# EAGLE schematic Hornet UFC 020a (EAGLE 9.2.2)
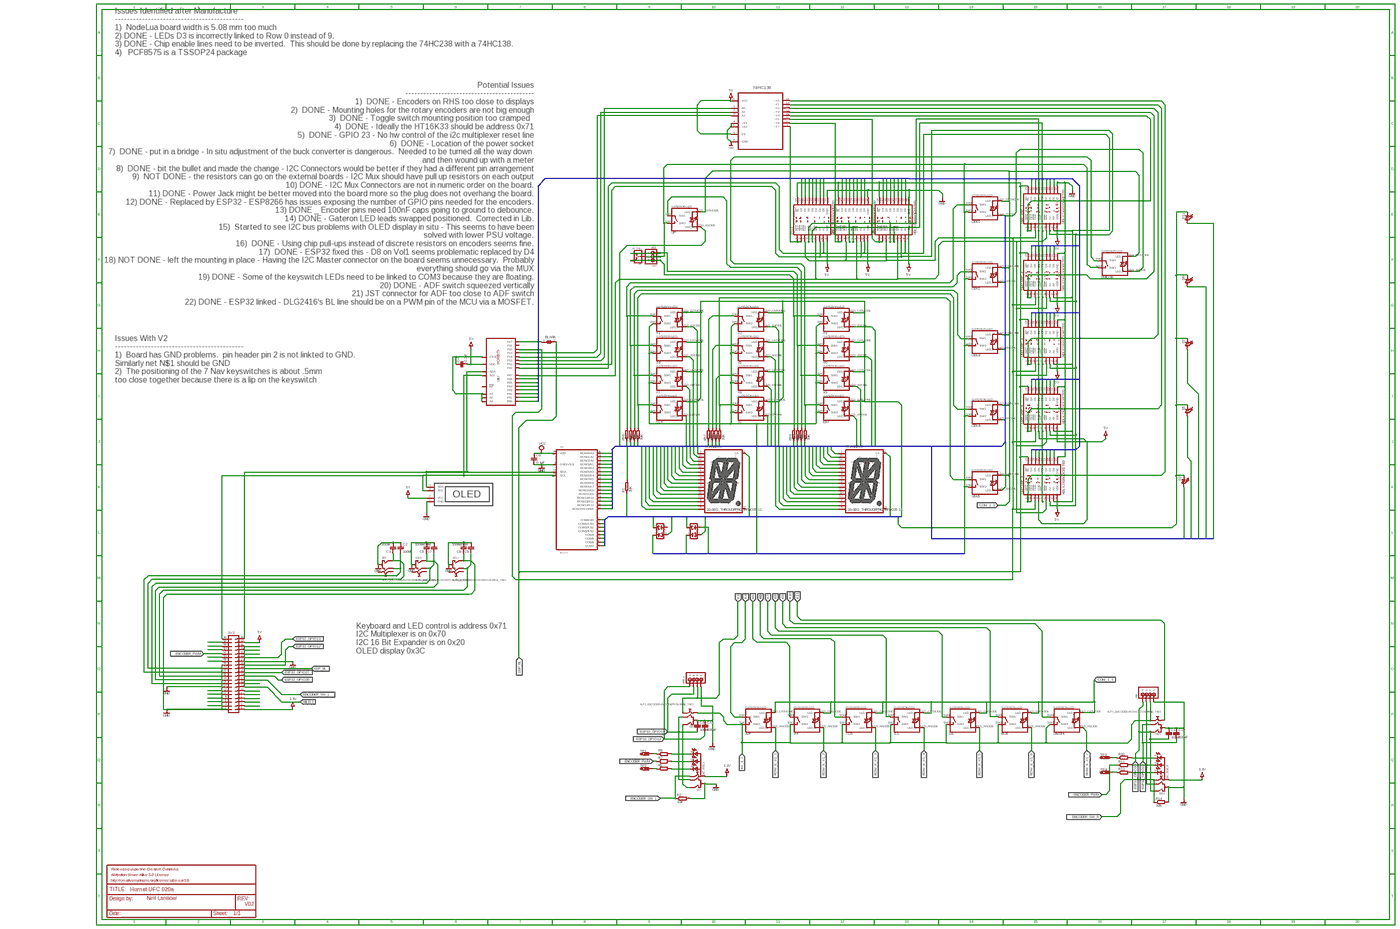
[diagram p0: schematic, sheet 1, overview]
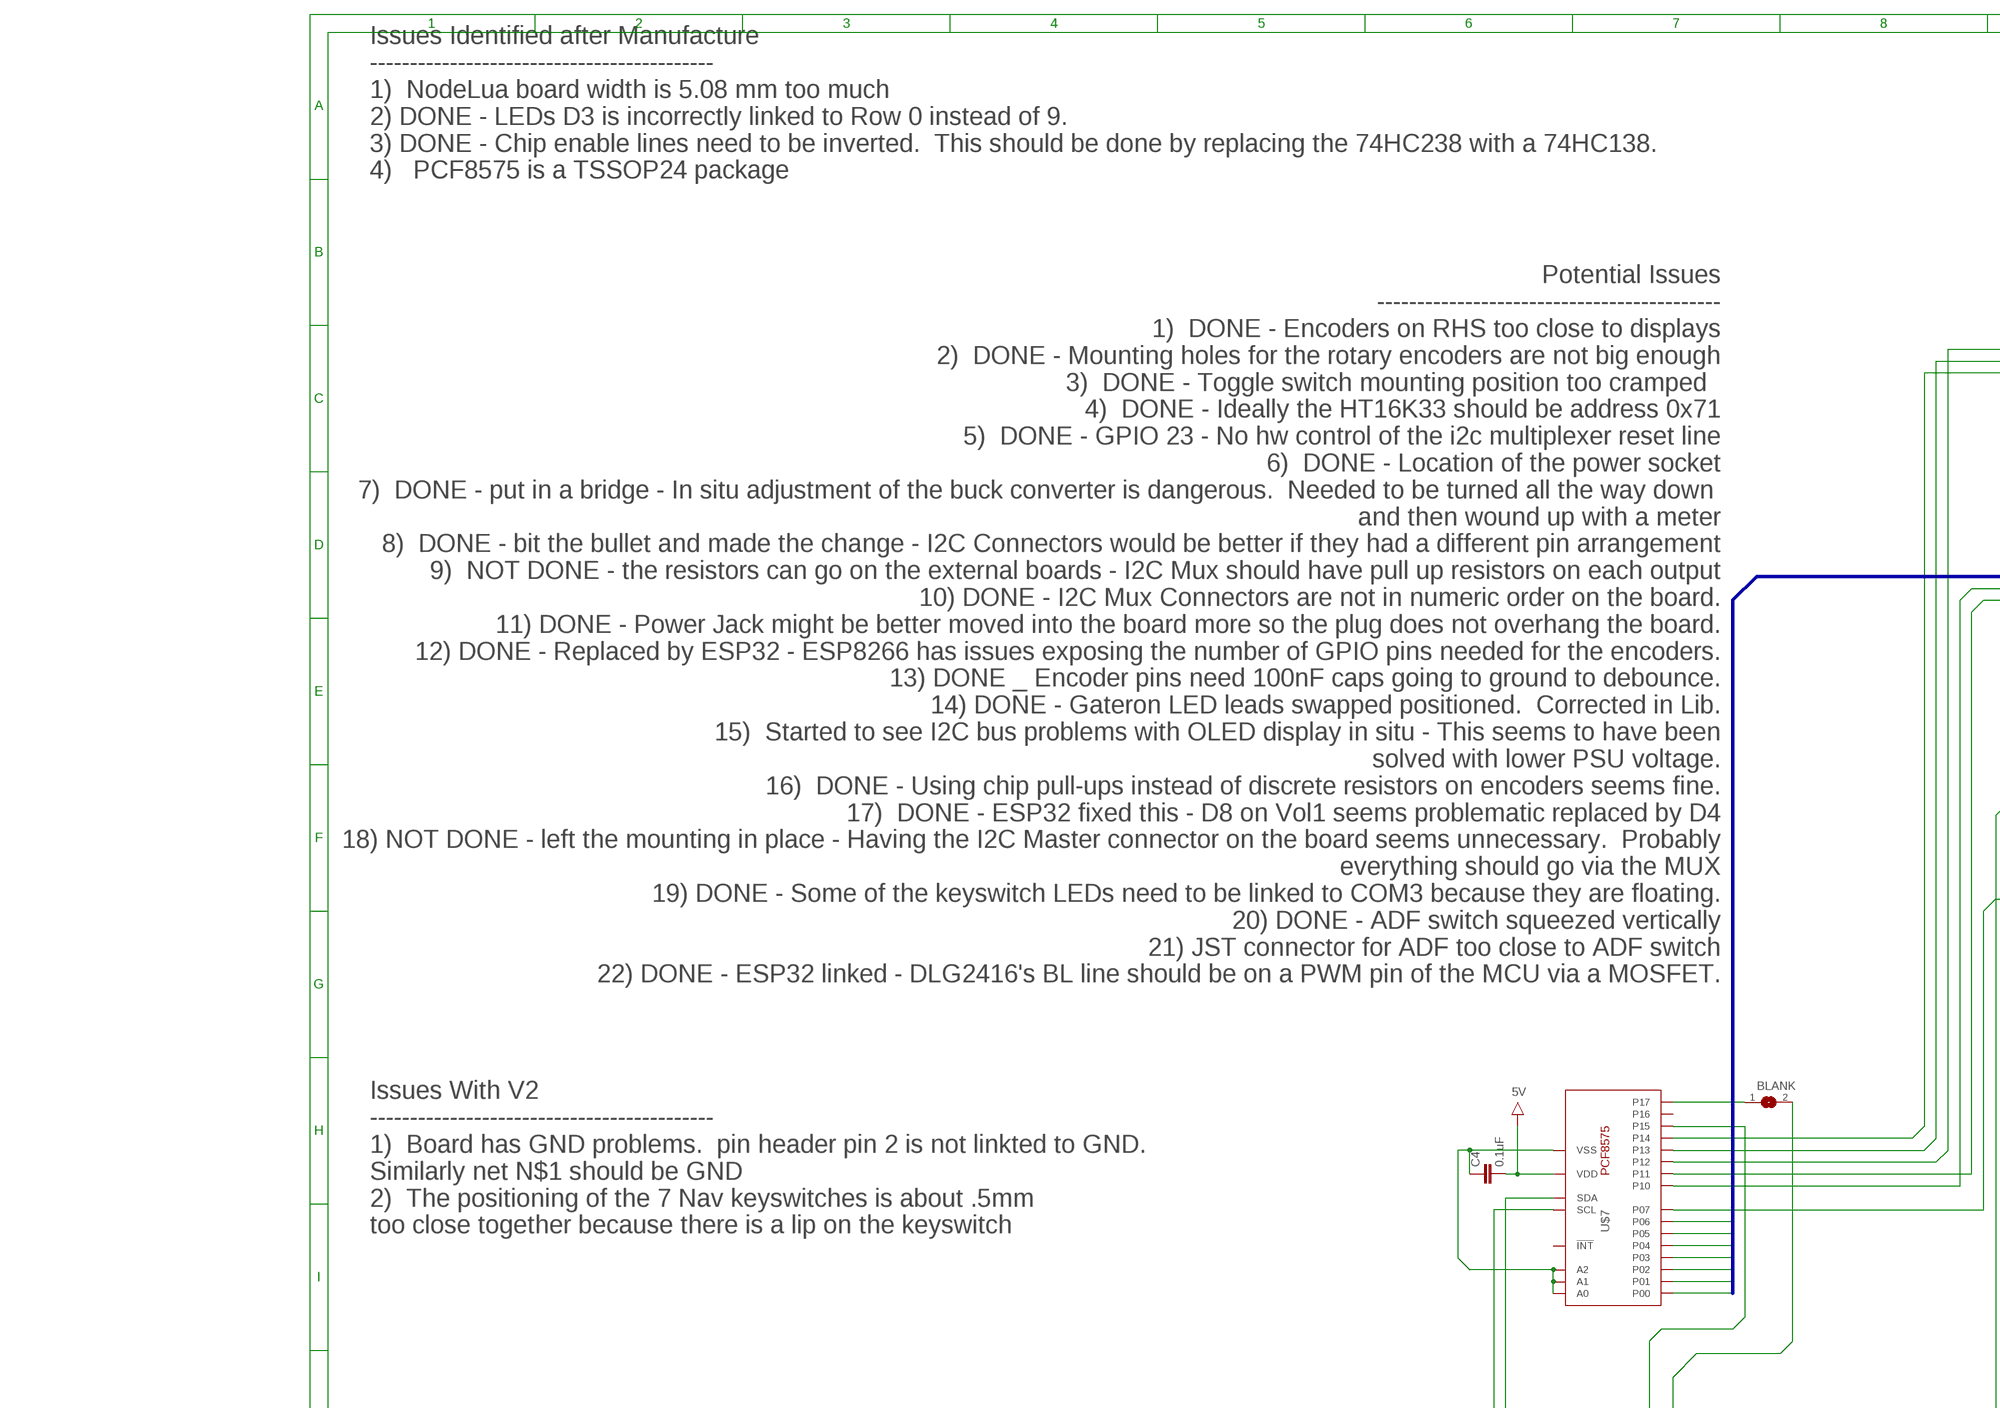
[diagram p1: schematic, sheet 1, part 1 of 6]
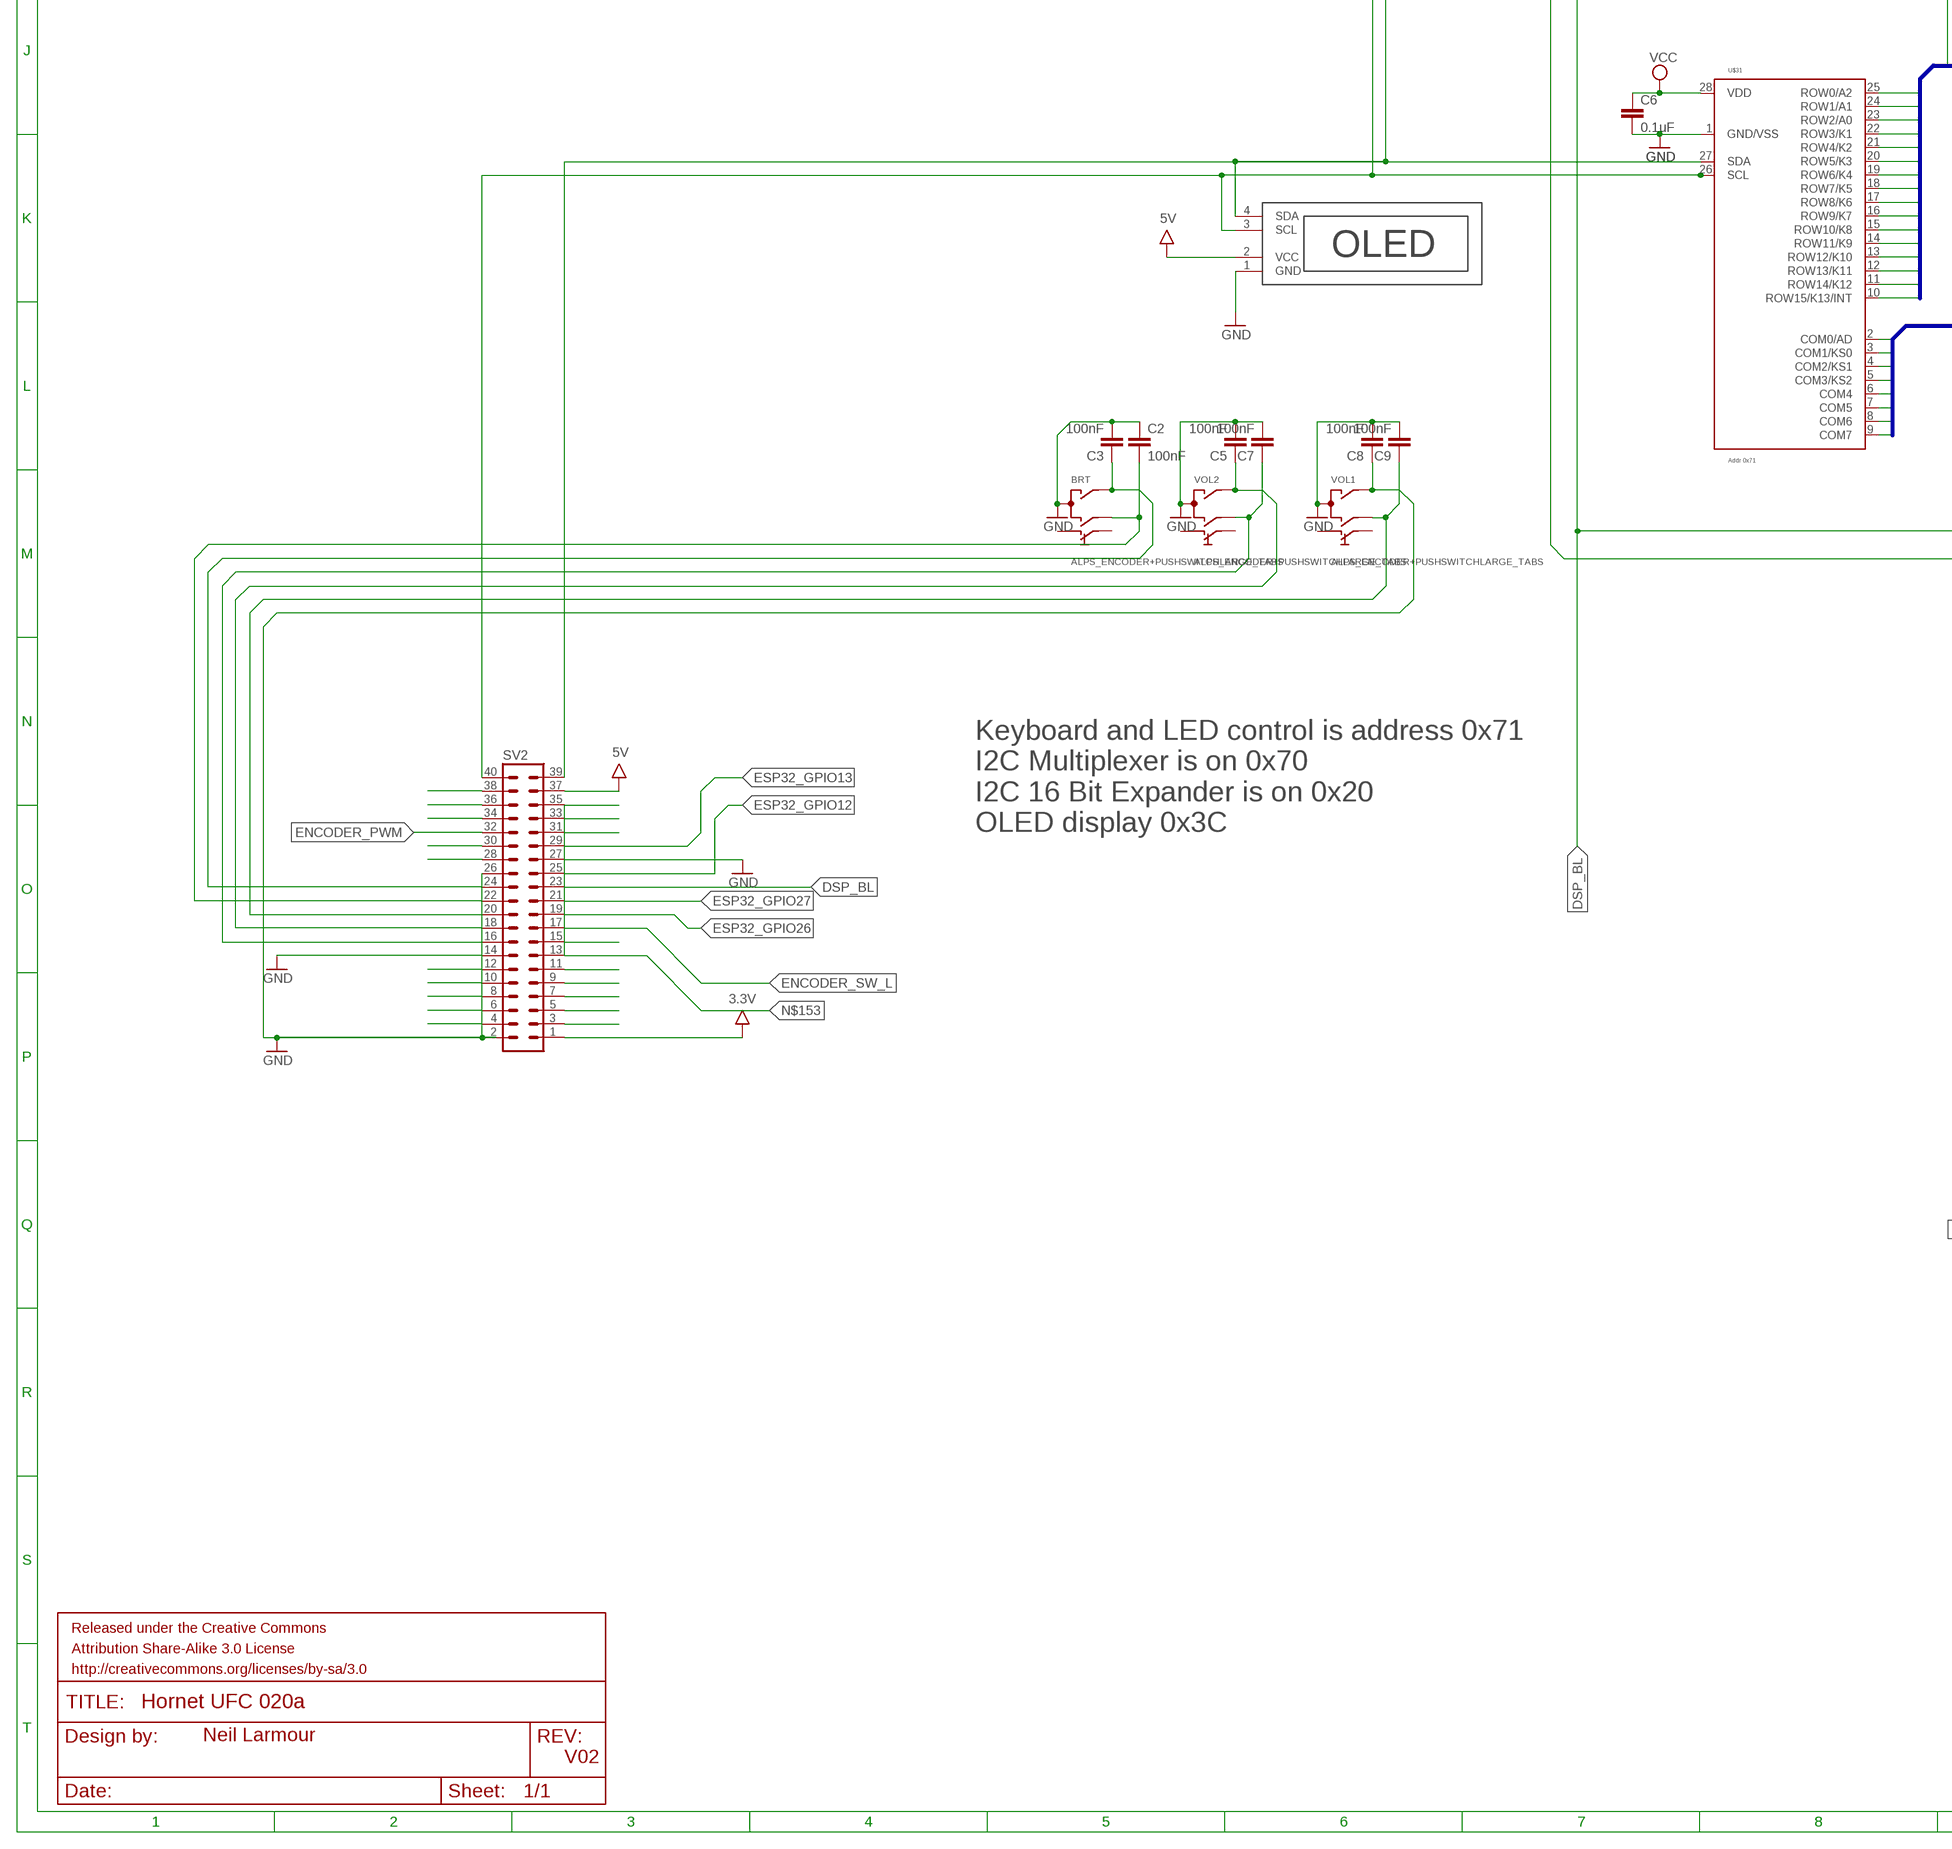
[diagram p2: schematic, sheet 1, part 2 of 6]
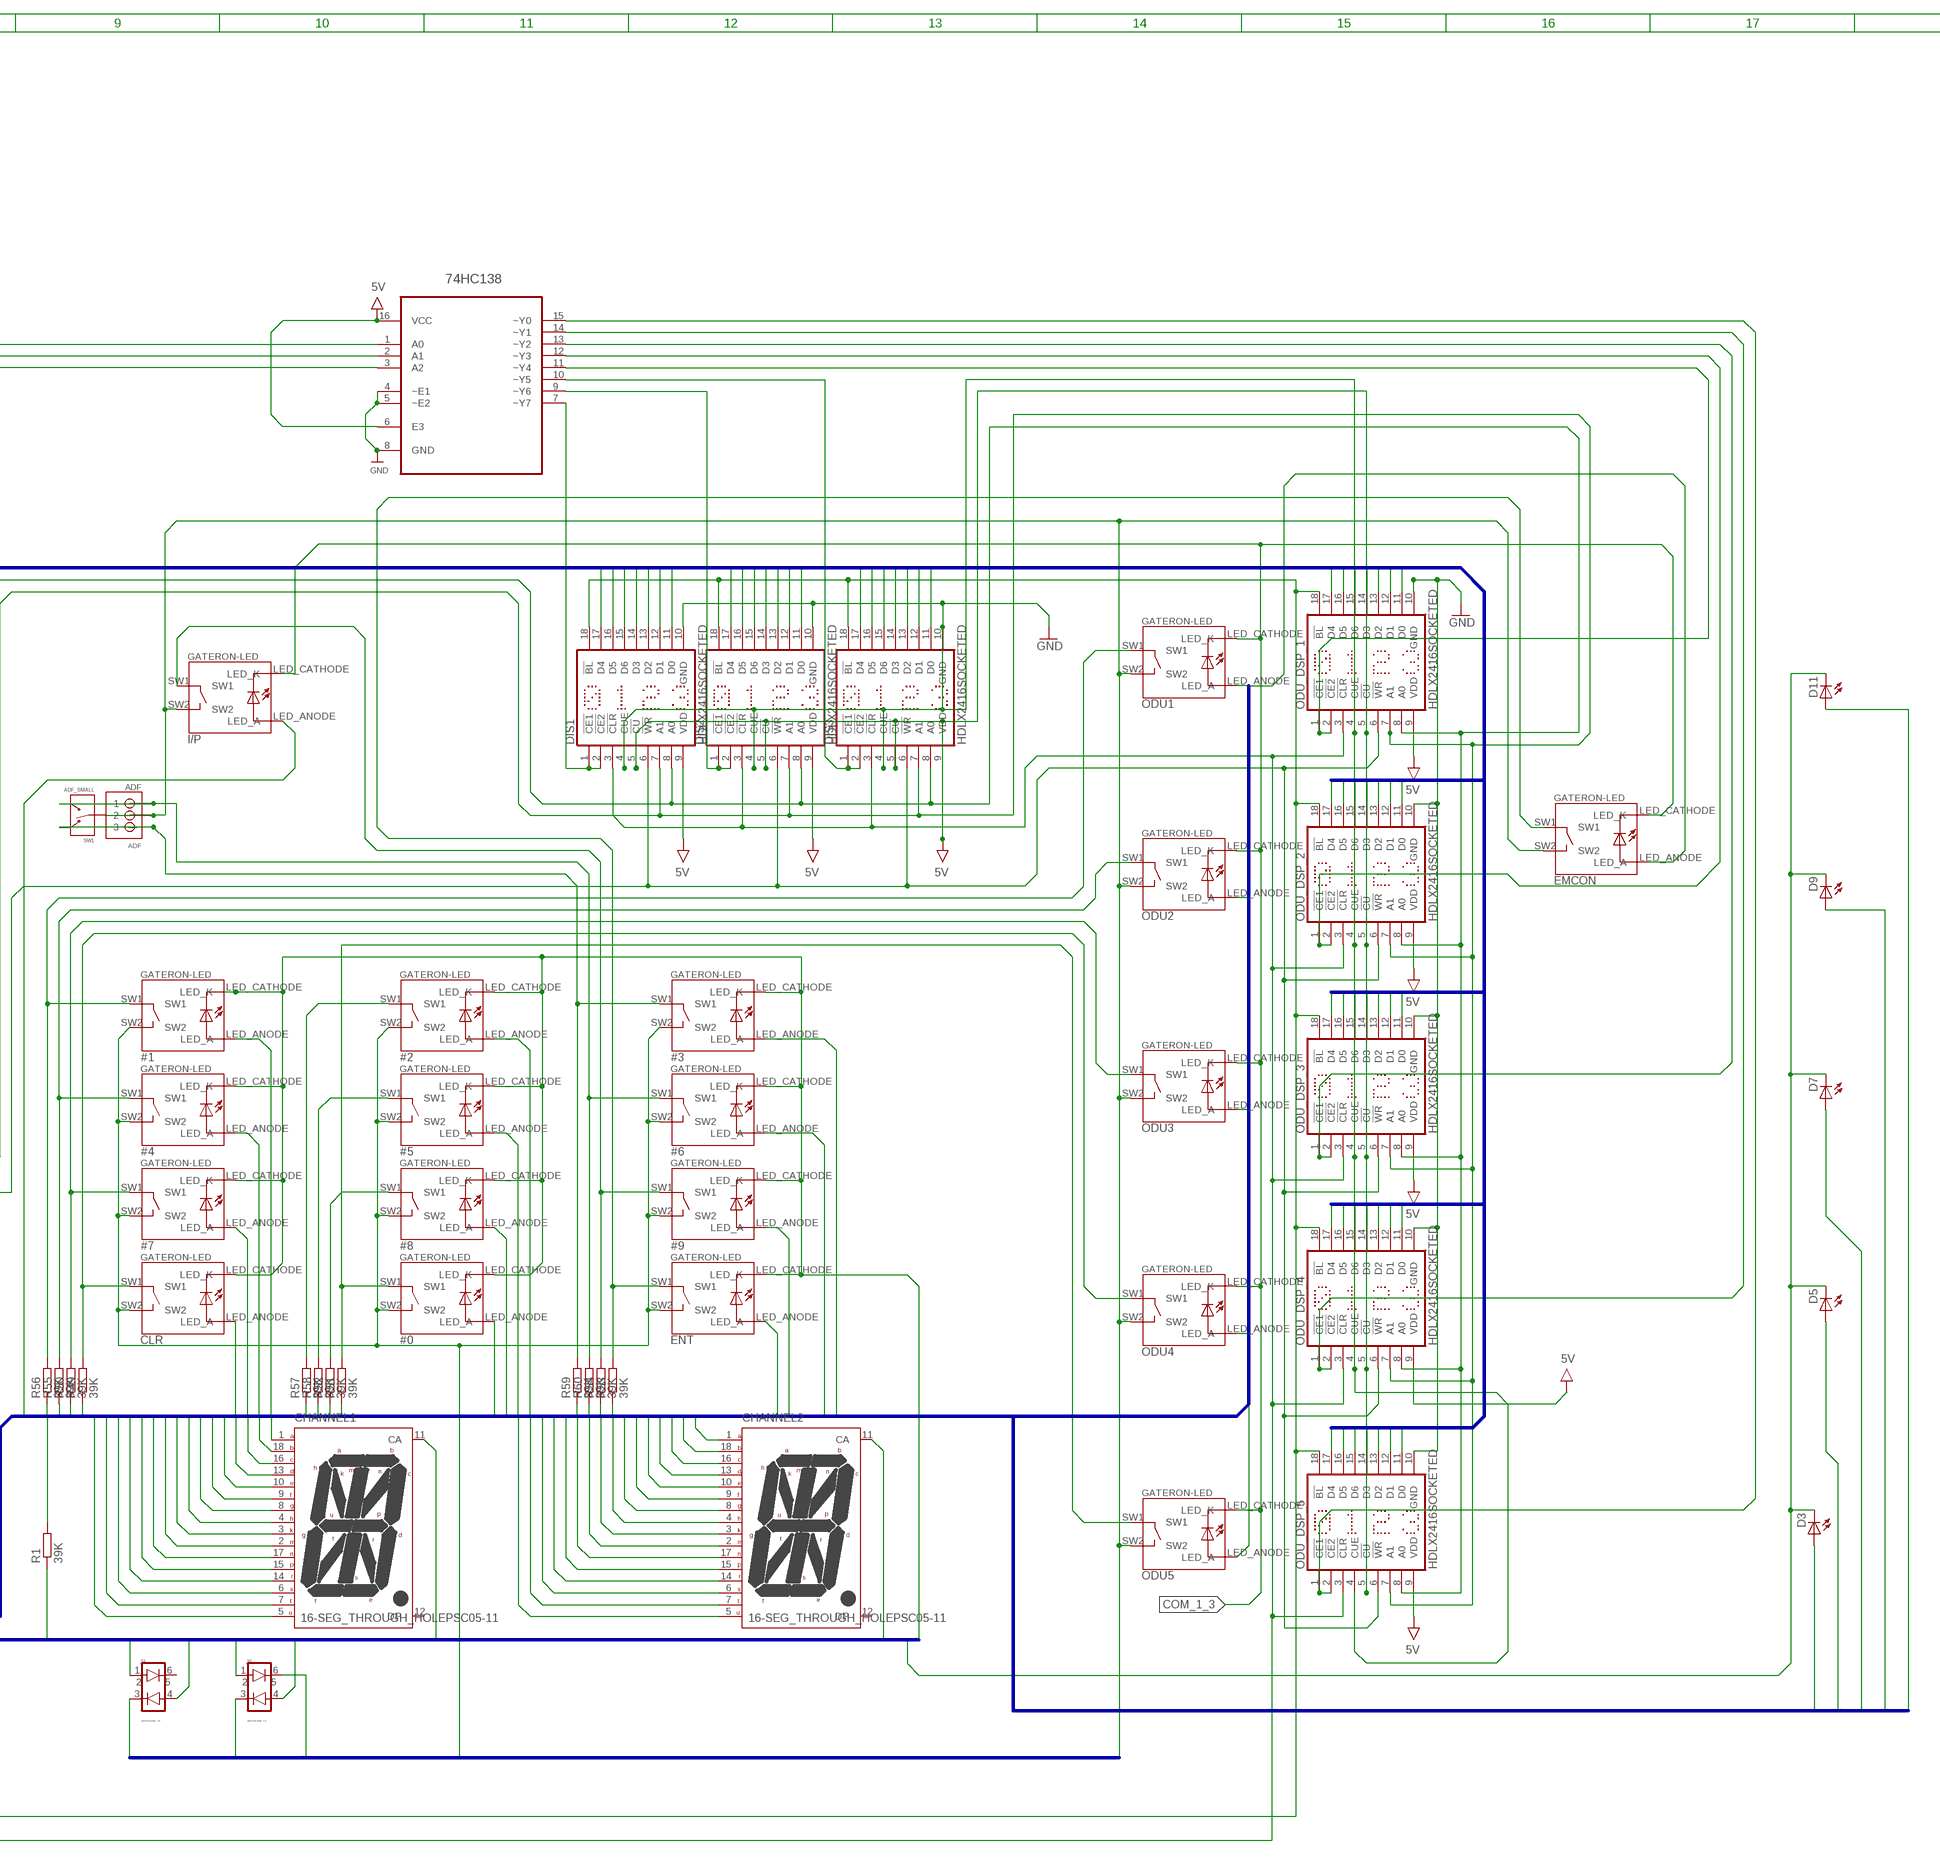
[diagram p3: schematic, sheet 1, part 3 of 6]
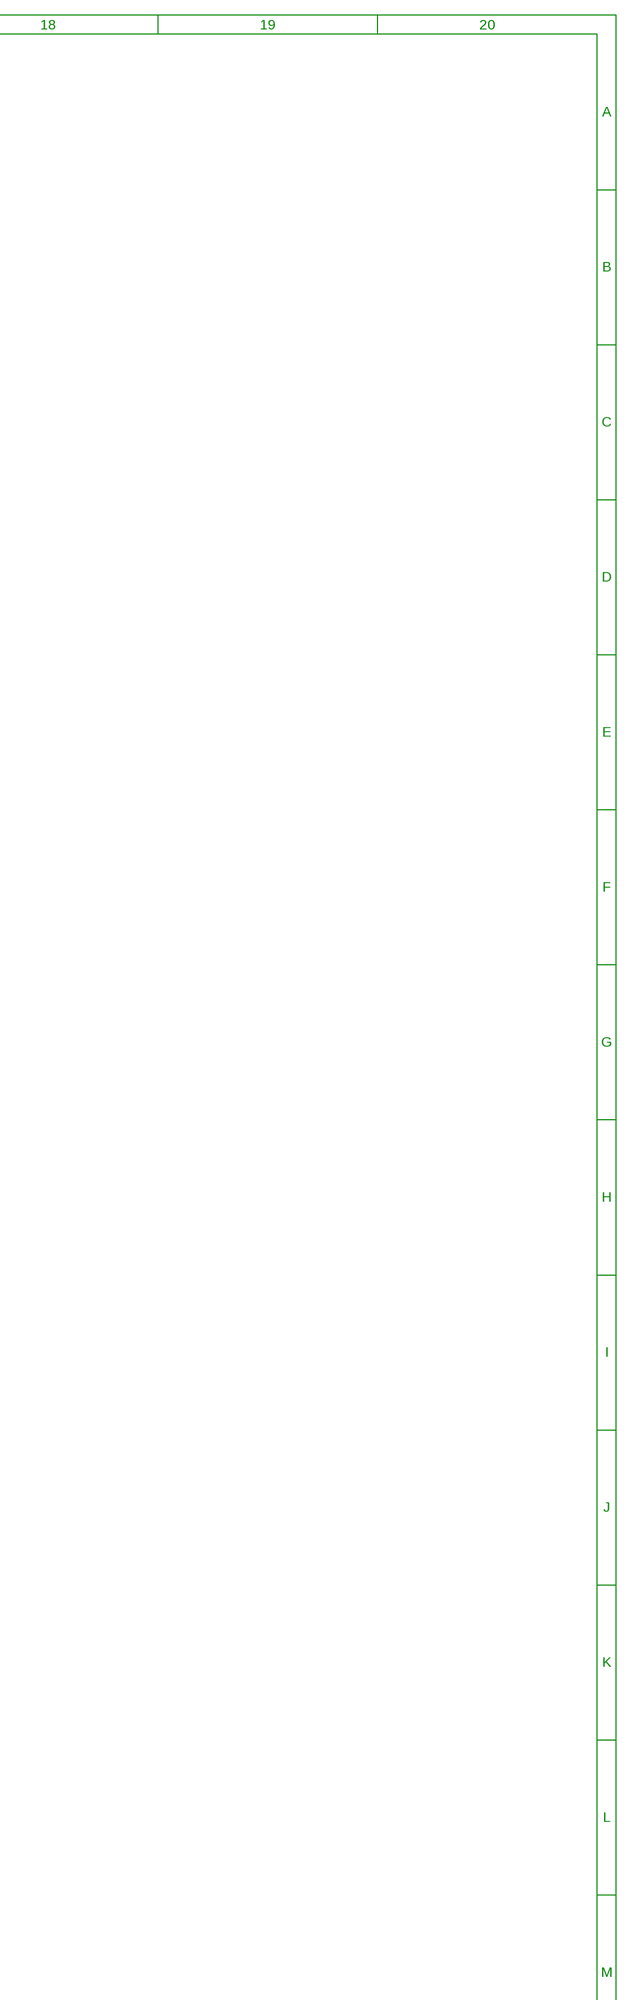
[diagram p4: schematic, sheet 1, part 4 of 6]
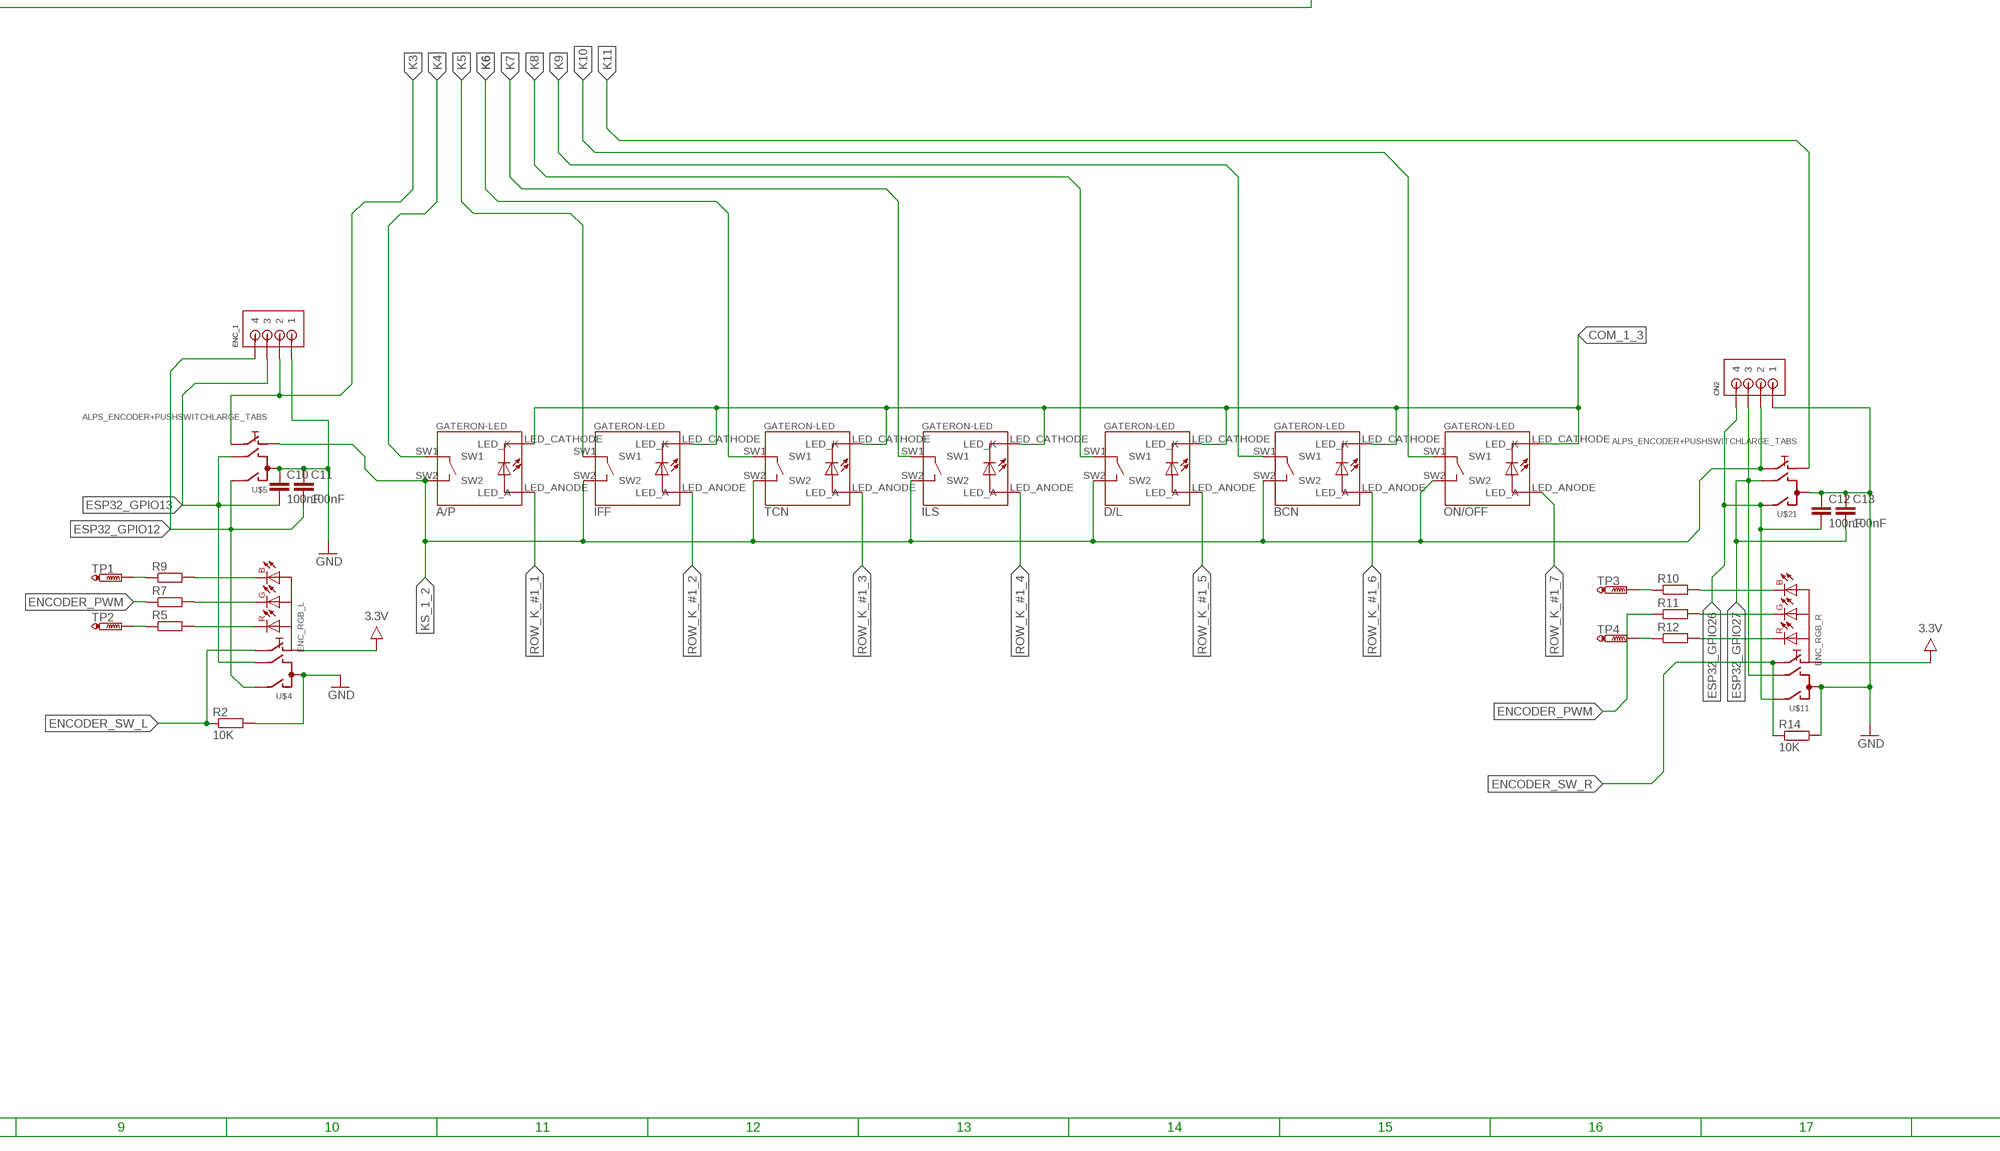
[diagram p5: schematic, sheet 1, part 5 of 6]
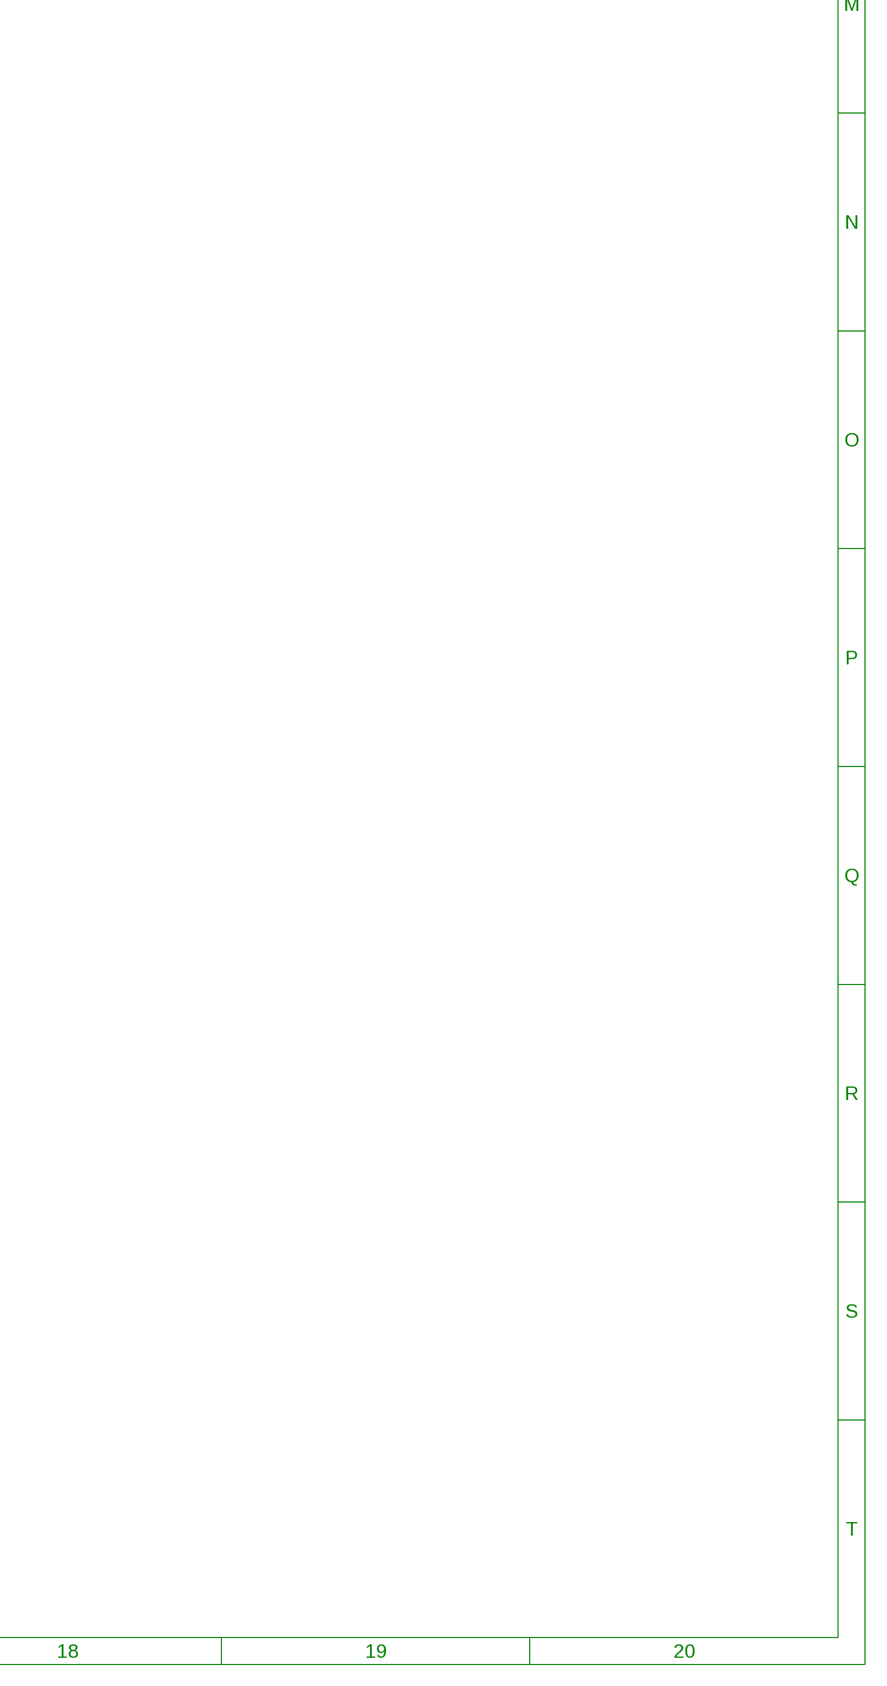
[diagram p6: schematic, sheet 1, part 6 of 6]

## Parts
74HC138  CD74HC138M  [SOIC127P600X175-16N]
#0  GATERON-LED  [GATERON-LED]
#1  GATERON-LED  [GATERON-LED]
#2  GATERON-LED  [GATERON-LED]
#3  GATERON-LED  [GATERON-LED]
#4  GATERON-LED  [GATERON-LED]
#5  GATERON-LED  [GATERON-LED]
#6  GATERON-LED  [GATERON-LED]
#7  GATERON-LED  [GATERON-LED]
#8  GATERON-LED  [GATERON-LED]
#9  GATERON-LED  [GATERON-LED]
A/P  GATERON-LED  [GATERON-LED]
ADF  ADF  JST-PH-B2B-SM3SOLDER  [B3B-PH-SOLDER]
BCN  GATERON-LED  [GATERON-LED]
BLANK  SOLDERJUMPERCLOSED  [SOLDERJUMPER_CLOSEDWIRE]
BRT  ALPS_ENCODER+PUSHSWITCHLARGE_TABS  [ENCODER+SWITCH_LARGER_TABS]
C2  100nF  C-EUC0805  [C0805]
C3  100nF  C-EUC0805  [C0805]
C4  0.1uF  C-EUC0805  [C0805]
C5  100nF  C-EUC0805  [C0805]
C6  0.1uF  C-EUC0805  [C0805]
C7  100nF  C-EUC0805  [C0805]
C8  100nF  C-EUC0805  [C0805]
C9  100nF  C-EUC0805  [C0805]
C10  100nF  C-EUC0805  [C0805]
C11  100nF  C-EUC0805  [C0805]
C12  100nF  C-EUC0805  [C0805]
C13  100nF  C-EUC0805  [C0805]
CHANNEL1  16-SEG_THROUGH_HOLEPSC05-11  [PSC05-11]
CHANNEL2  16-SEG_THROUGH_HOLEPSC05-11  [PSC05-11]
CLR  GATERON-LED  [GATERON-LED]
CN2  JST-PH-B4B-PH-SM4THRU-HOLE  [B4B-PH-SOLDER]
D1  BAT54CDW-7-F  [SSOT6]
D2  BAT54CDW-7-F  [SSOT6]
D3  LED3MM_V_OFFSET  [LED5X2MM_RECT_3MM_VOFFSET]
D5  LED3MM_V_OFFSET  [LED5X2MM_RECT_3MM_VOFFSET]
D7  LED3MM_V_OFFSET  [LED5X2MM_RECT_3MM_VOFFSET]
D9  LED3MM_V_OFFSET  [LED5X2MM_RECT_3MM_VOFFSET]
D11  LED3MM_V_OFFSET  [LED5X2MM_RECT_3MM_VOFFSET]
D/L  GATERON-LED  [GATERON-LED]
DIS1  HDLX2416SOCKETED  [HDLX2416(SOCKETED)]
DIS2  HDLX2416SOCKETED  [HDLX2416(SOCKETED)]
DIS3  HDLX2416SOCKETED  [HDLX2416(SOCKETED)]
EMCON  GATERON-LED  [GATERON-LED]
ENC_1  JST-PH-B4B-PH-SM4THRU-HOLE  [B4B-PH-SOLDER]
ENT  GATERON-LED  [GATERON-LED]
I/P  GATERON-LED  [GATERON-LED]
IFF  GATERON-LED  [GATERON-LED]
ILS  GATERON-LED  [GATERON-LED]
ODU1  GATERON-LED  [GATERON-LED]
ODU2  GATERON-LED  [GATERON-LED]
ODU3  GATERON-LED  [GATERON-LED]
ODU4  GATERON-LED  [GATERON-LED]
ODU5  GATERON-LED  [GATERON-LED]
ODU_DSP_1  HDLX2416SOCKETED  [HDLX2416(SOCKETED)]
ODU_DSP_2  HDLX2416SOCKETED  [HDLX2416(SOCKETED)]
ODU_DSP_3  HDLX2416SOCKETED  [HDLX2416(SOCKETED)]
ODU_DSP_4  HDLX2416SOCKETED  [HDLX2416(SOCKETED)]
ODU_DSP_5  HDLX2416SOCKETED  [HDLX2416(SOCKETED)]
ON/OFF  GATERON-LED  [GATERON-LED]
R1  39K  R-EU_R1206  [R1206]
R2  10K  R-EU_R0805  [R0805]
R5  R-EU_R0805  [R0805]
R7  R-EU_R0805  [R0805]
R9  R-EU_R0805  [R0805]
R10  R-EU_R0805  [R0805]
R11  R-EU_R0805  [R0805]
R12  R-EU_R0805  [R0805]
R14  10K  R-EU_R0805  [R0805]
R49  39K  R-EU_R1206  [R1206]
R50  39K  R-EU_R1206  [R1206]
R51  39K  R-EU_R1206  [R1206]
R52  39K  R-EU_R1206  [R1206]
R53  39K  R-EU_R1206  [R1206]
R54  39K  R-EU_R1206  [R1206]
R55  39K  R-EU_R1206  [R1206]
R56  39K  R-EU_R1206  [R1206]
R57  39K  R-EU_R1206  [R1206]
R58  39K  R-EU_R1206  [R1206]
R59  39K  R-EU_R1206  [R1206]
R60  39K  R-EU_R1206  [R1206]
SV2  MA20-2  [MA20-2]
SW1  ADF_SMALL  MICRO_TOGGLE_SPDT_TOP  [MICRO_TOGGLE_SPDT]
TCN  GATERON-LED  [GATERON-LED]
TP1  PTR1TP13SQ  [TP13SQ]
TP2  PTR1TP13SQ  [TP13SQ]
TP3  PTR1TP13SQ  [TP13SQ]
TP4  PTR1TP13SQ  [TP13SQ]
U$4  ENC_RGB_L  ENCODER_RGB_SWITCHTHROUGHHOLE  [ENCODER_RGB]
U$5  ALPS_ENCODER+PUSHSWITCHLARGE_TABS  [ENCODER+SWITCH_LARGER_TABS]
U$7  PCF8575PWR  [TSSOP24]
U$11  ENC_RGB_R  ENCODER_RGB_SWITCHTHROUGHHOLE  [ENCODER_RGB]
U$21  ALPS_ENCODER+PUSHSWITCHLARGE_TABS  [ENCODER+SWITCH_LARGER_TABS]
U$31  Addr 0x71  HOLTEK_HT16K33  [SOIC28]
U$37  OLED_128X32_I2C_DISPLAYTHROUGH_HOLE  [OLED128X32_GRAPHICS_MODULE]
VOL1  ALPS_ENCODER+PUSHSWITCHLARGE_TABS  [ENCODER+SWITCH_LARGER_TABS]
VOL2  ALPS_ENCODER+PUSHSWITCHLARGE_TABS  [ENCODER+SWITCH_LARGER_TABS]

## Nets
3.3V: U$4.ANODE(VCC) U$11.ANODE(VCC)
3V3 [power]: SV2.1 ; supply symbol labelled 3.3V
5V [power]: 74HC138.6(E3) 74HC138.16(VCC) C4.2 C6.1 DIS1.5(!CU) DIS1.9(VDD) DIS2.5(!CU) DIS2.9(VDD) DIS3.5(!CU) DIS3.9(VDD) ODU_DSP_1.5(!CU) ODU_DSP_1.9(VDD) ODU_DSP_2.5(!CU) ODU_DSP_2.9(VDD) ODU_DSP_3.5(!CU) ODU_DSP_3.9(VDD) ODU_DSP_4.5(!CU) ODU_DSP_4.9(VDD) ODU_DSP_5.5(!CU) ODU_DSP_5.9(VDD) SV2.37 U$7.24(VDD) U$31.28(VDD) U$37.2(VCC) ; supply symbol labelled VCC
COM_1_0: CHANNEL1.11(CA) D1.1(A1) R1.1 U$31.2(COM0/AD)
COM_1_1: CHANNEL2.11(CA) D1.4(A2) U$31.3(COM1/KS0)
COM_1_2: #0.LED_CATHODE(LED_K) #1.LED_CATHODE(LED_K) #2.LED_CATHODE(LED_K) #3.LED_CATHODE(LED_K) #4.LED_CATHODE(LED_K) #5.LED_CATHODE(LED_K) #6.LED_CATHODE(LED_K) #7.LED_CATHODE(LED_K) #8.LED_CATHODE(LED_K) #9.LED_CATHODE(LED_K) CLR.LED_CATHODE(LED_K) D2.1(A1) ENT.LED_CATHODE(LED_K) U$31.4(COM2/KS1)
COM_1_3: A/P.LED_CATHODE(LED_K) BCN.LED_CATHODE(LED_K) D2.4(A2) D/L.LED_CATHODE(LED_K) EMCON.LED_CATHODE(LED_K) I/P.LED_CATHODE(LED_K) IFF.LED_CATHODE(LED_K) ILS.LED_CATHODE(LED_K) ODU1.LED_CATHODE(LED_K) ODU2.LED_CATHODE(LED_K) ODU3.LED_CATHODE(LED_K) ODU4.LED_CATHODE(LED_K) ODU5.LED_CATHODE(LED_K) ON/OFF.LED_CATHODE(LED_K) TCN.LED_CATHODE(LED_K) U$31.5(COM3/KS2)
COM_1_4: D3.K(C) D5.K(C) D7.K(C) D9.K(C) D11.K(C) U$31.6(COM4)
COM_1_5: U$31.7(COM5)
COM_1_6: U$31.8(COM6)
COM_1_7: U$31.9(COM7)
D0: DIS1.11(D0) DIS2.11(D0) DIS3.11(D0) ODU_DSP_1.11(D0) ODU_DSP_2.11(D0) ODU_DSP_3.11(D0) ODU_DSP_4.11(D0) ODU_DSP_5.11(D0) U$7.4(P00)
D1: DIS1.12(D1) DIS2.12(D1) DIS3.12(D1) ODU_DSP_1.12(D1) ODU_DSP_2.12(D1) ODU_DSP_3.12(D1) ODU_DSP_4.12(D1) ODU_DSP_5.12(D1) U$7.5(P01)
D2: DIS1.13(D2) DIS2.13(D2) DIS3.13(D2) ODU_DSP_1.13(D2) ODU_DSP_2.13(D2) ODU_DSP_3.13(D2) ODU_DSP_4.13(D2) ODU_DSP_5.13(D2) U$7.6(P02)
D3: DIS1.14(D3) DIS2.14(D3) DIS3.14(D3) ODU_DSP_1.14(D3) ODU_DSP_2.14(D3) ODU_DSP_3.14(D3) ODU_DSP_4.14(D3) ODU_DSP_5.14(D3) U$7.7(P03)
D4: DIS1.17(D4) DIS2.17(D4) DIS3.17(D4) ODU_DSP_1.17(D4) ODU_DSP_2.17(D4) ODU_DSP_3.17(D4) ODU_DSP_4.17(D4) ODU_DSP_5.17(D4) U$7.8(P04)
D5: DIS1.16(D5) DIS2.16(D5) DIS3.16(D5) ODU_DSP_1.16(D5) ODU_DSP_2.16(D5) ODU_DSP_3.16(D5) ODU_DSP_4.16(D5) ODU_DSP_5.16(D5) U$7.9(P05)
D6: DIS1.15(D6) DIS2.15(D6) DIS3.15(D6) ODU_DSP_1.15(D6) ODU_DSP_2.15(D6) ODU_DSP_3.15(D6) ODU_DSP_4.15(D6) ODU_DSP_5.15(D6) U$7.10(P06)
DSP3: BRT.B C2.2 SV2.22
DSP_A0: DIS1.8(A0) DIS2.8(A0) DIS3.8(A0) ODU_DSP_1.8(A0) ODU_DSP_2.8(A0) ODU_DSP_3.8(A0) ODU_DSP_4.8(A0) ODU_DSP_5.8(A0) U$7.13(P10)
DSP_A1: DIS1.7(A1) DIS2.7(A1) DIS3.7(A1) ODU_DSP_1.7(A1) ODU_DSP_2.7(A1) ODU_DSP_3.7(A1) ODU_DSP_4.7(A1) ODU_DSP_5.7(A1) U$7.14(P11)
DSP_BL: BLANK.2 DIS1.18(!BL) DIS2.18(!BL) DIS3.18(!BL) ODU_DSP_1.18(!BL) ODU_DSP_2.18(!BL) ODU_DSP_3.18(!BL) ODU_DSP_4.18(!BL) ODU_DSP_5.18(!BL) SV2.23
DSP_CLR: DIS1.3(!CLR) DIS2.3(!CLR) DIS3.3(!CLR) ODU_DSP_1.3(!CLR) ODU_DSP_2.3(!CLR) ODU_DSP_3.3(!CLR) ODU_DSP_4.3(!CLR) ODU_DSP_5.3(!CLR) U$7.18(P15)
ENCODER_PWM: R7.1 R11.1 SV2.32
ENCODER_SW_L: R2.1 SV2.17 U$4.SWITCH(E)
ENCODER_SW_R: R14.1 U$11.SWITCH(E)
ESP32_GPIO12: C11.2 ENC_1.P4 SV2.25 U$4.A U$5.A
ESP32_GPIO13: C10.2 ENC_1.P3 SV2.29 U$4.B U$5.B
ESP32_GPIO26: C12.2 CN2.P4 SV2.19 U$11.A U$21.A
ESP32_GPIO27: C13.2 CN2.P3 SV2.21 U$11.B U$21.B
GND [power]: 74HC138.4(~E1) 74HC138.5(~E2) 74HC138.8(GND) BRT.C C2.1 C3.2 C5.2 C6.2 C7.2 C8.1 C8.2 C9.2 C10.1 C11.1 C12.1 C13.1 CN2.P1 DIS1.4(CUE) DIS1.10(GND) DIS2.4(CUE) DIS2.10(GND) DIS3.4(CUE) DIS3.10(GND) ENC_1.P1 ODU_DSP_1.4(CUE) ODU_DSP_1.10(GND) ODU_DSP_2.4(CUE) ODU_DSP_2.10(GND) ODU_DSP_3.4(CUE) ODU_DSP_3.10(GND) ODU_DSP_4.4(CUE) ODU_DSP_4.10(GND) ODU_DSP_5.4(CUE) ODU_DSP_5.10(GND) R2.2 R14.2 SV2.2 SV2.14 SV2.26 SV2.27 U$4.C U$5.C U$11.C U$21.C U$31.1(GND/VSS) U$37.1(GND) VOL1.A VOL1.C VOL2.C
I2C_0: SV2.39 U$7.23(SDA) U$31.27(SDA) U$37.4(SDA)
I2C_1: SV2.40 U$7.22(SCL) U$31.26(SCL) U$37.3(SCL)
K3: #1.SW1 ENC_1.P2 ODU1.SW1 R56.2 U$5.E
K4: #2.SW1 A/P.SW1 R57.2
K5: #3.SW1 ADF.P3 IFF.SW1 R59.2 SW1.A$1
K6: #4.SW1 ODU2.SW1 R55.2 TCN.SW1
K7: #5.SW1 ILS.SW1 R58.2
K8: #6.SW1 ADF.P1 D/L.SW1 R60.2 SW1.B$1
K9: #7.SW1 BCN.SW1 ODU3.SW1 R50.2
K10: #8.SW1 ON/OFF.SW1 R52.2
K11: #9.SW1 I/P.SW1 R54.2 U$21.D
K12: CLR.SW1 ODU4.SW1 R49.2
K13: #0.SW1 ODU5.SW1 R51.2
K14: EMCON.SW1 ENT.SW1 R53.2
KS_1_0: #0.SW2 #1.SW2 #2.SW2 #3.SW2 #4.SW2 #5.SW2 #6.SW2 #7.SW2 #8.SW2 #9.SW2 CLR.SW2 D1.3(C2) ENT.SW2
KS_1_1: ADF.P2 D2.6(C1) EMCON.SW2 I/P.SW2 ODU1.SW2 ODU2.SW2 ODU3.SW2 ODU4.SW2 ODU5.SW2 SW1.C$1
KS_1_2: A/P.SW2 BCN.SW2 CN2.P2 D2.3(C2) D/L.SW2 IFF.SW2 ILS.SW2 ON/OFF.SW2 TCN.SW2 U$5.D U$21.E
N$1 [power]: C4.1 U$7.2(A1) U$7.3(A2) U$7.12(VSS) U$7.21(A0)
N$2: R9.2 U$4.BLUE(LED_B)
N$5: 74HC138.1(A0) U$7.15(P12)
N$6: 74HC138.2(A1) U$7.16(P13)
N$7: BLANK.1 U$7.20(P17)
N$8: 74HC138.3(A2) U$7.17(P14)
N$9: 74HC138.10(~Y5) DIS3.1(!CE1) DIS3.2(!CE2)
N$10: C9.1 SV2.20 VOL1.B
N$11: 74HC138.7(~Y7) DIS1.1(!CE1) DIS1.2(!CE2)
N$13: 74HC138.9(~Y6) DIS2.1(!CE1) DIS2.2(!CE2)
N$14: 74HC138.11(~Y4) ODU_DSP_1.1(!CE1) ODU_DSP_1.2(!CE2)
N$15: 74HC138.12(~Y3) ODU_DSP_2.1(!CE1) ODU_DSP_2.2(!CE2)
N$16: 74HC138.13(~Y2) ODU_DSP_3.1(!CE1) ODU_DSP_3.2(!CE2)
N$17: 74HC138.14(~Y1) ODU_DSP_4.1(!CE1) ODU_DSP_4.2(!CE2)
N$18: 74HC138.15(~Y0) ODU_DSP_5.1(!CE1) ODU_DSP_5.2(!CE2)
N$19: DIS1.6(!WR) DIS2.6(!WR) DIS3.6(!WR) ODU_DSP_1.6(!WR) ODU_DSP_2.6(!WR) ODU_DSP_3.6(!WR) ODU_DSP_4.6(!WR) ODU_DSP_5.6(!WR) U$7.11(P07)
N$22: BRT.A C3.1 SV2.24
N$29: R7.2 U$4.GREEN(LED_G)
N$32: R12.2 U$11.RED(LED_R)
N$33: R11.2 U$11.GREEN(LED_G)
N$34: R10.2 U$11.BLUE(LED_B)
N$36: R5.2 U$4.RED(LED_R)
N$41: R12.1 TP4.TP
N$43: R5.1 TP2.TP
N$46: R9.1 TP1.TP
N$49: R10.1 TP3.TP
N$60: C5.1 SV2.18 VOL2.A
N$65: C7.1 SV2.16 VOL2.B
N$145: SV2.3
N$146: SV2.5
N$147: SV2.7
N$148: SV2.9
N$149: SV2.11
N$150: SV2.15
N$151: SV2.31
N$152: SV2.33
N$153: SV2.13 SV2.35
N$154: SV2.38
N$155: SV2.36
N$156: SV2.34
N$157: SV2.30
N$158: SV2.28
N$159: SV2.10
N$160: SV2.8
ROW_K_#1_0: #1.LED_ANODE(LED_A) CHANNEL1.1(A) CHANNEL2.1(A) ODU1.LED_ANODE(LED_A) U$31.25(ROW0/A2)
ROW_K_#1_1: #2.LED_ANODE(LED_A) A/P.LED_ANODE(LED_A) CHANNEL1.18(B) CHANNEL2.18(B) D11.A ODU2.LED_ANODE(LED_A) U$31.24(ROW1/A1)
ROW_K_#1_2: #3.LED_ANODE(LED_A) CHANNEL1.16(C) CHANNEL2.16(C) IFF.LED_ANODE(LED_A) ODU3.LED_ANODE(LED_A) R1.2 U$31.23(ROW2/A0)
ROW_K_#1_3: #4.LED_ANODE(LED_A) CHANNEL1.13(D) CHANNEL2.13(D) D9.A ODU4.LED_ANODE(LED_A) R56.1 TCN.LED_ANODE(LED_A) U$31.22(ROW3/K1)
ROW_K_#1_4: #5.LED_ANODE(LED_A) CHANNEL1.10(E) CHANNEL2.10(E) ILS.LED_ANODE(LED_A) ODU5.LED_ANODE(LED_A) R57.1 U$31.21(ROW4/K2)
ROW_K_#1_5: #6.LED_ANODE(LED_A) CHANNEL1.9(F) CHANNEL2.9(F) D7.A D/L.LED_ANODE(LED_A) EMCON.LED_ANODE(LED_A) R59.1 U$31.20(ROW5/K3)
ROW_K_#1_6: #7.LED_ANODE(LED_A) BCN.LED_ANODE(LED_A) CHANNEL1.8(G) CHANNEL2.8(G) I/P.LED_ANODE(LED_A) R55.1 U$31.19(ROW6/K4)
ROW_K_#1_7: #8.LED_ANODE(LED_A) CHANNEL1.4(H) CHANNEL2.4(H) D5.A ON/OFF.LED_ANODE(LED_A) R58.1 U$31.18(ROW7/K5)
ROW_K_#1_8: #9.LED_ANODE(LED_A) CHANNEL1.3(K) CHANNEL2.3(K) R60.1 U$31.17(ROW8/K6)
ROW_K_#1_9: CHANNEL1.2(M) CHANNEL2.2(M) CLR.LED_ANODE(LED_A) D3.A R50.1 U$31.16(ROW9/K7)
ROW_K_#1_10: #0.LED_ANODE(LED_A) CHANNEL1.17(N) CHANNEL2.17(N) R52.1 U$31.15(ROW10/K8)
ROW_K_#1_11: CHANNEL1.15(P) CHANNEL2.15(P) ENT.LED_ANODE(LED_A) R54.1 U$31.14(ROW11/K9)
ROW_K_#1_12: CHANNEL1.14(R) CHANNEL2.14(R) R49.1 U$31.13(ROW12/K10)
ROW_K_#1_13: CHANNEL1.6(S) CHANNEL2.6(S) R51.1 U$31.12(ROW13/K11)
ROW_K_#1_14: CHANNEL1.7(T) CHANNEL2.7(T) R53.1 U$31.11(ROW14/K12)
ROW_K_#1_15: CHANNEL1.5(U) CHANNEL2.5(U) U$31.10(ROW15/K13/INT)
SCL3V3: SV2.6
SDA3V1: SV2.4
SDA3V3: SV2.12
Unconnected: BRT.D BRT.E CHANNEL1.12(DP) CHANNEL2.12(DP) D1.2(NC0) D1.5(NC1) D1.6(C1) D2.2(NC0) D2.5(NC1) U$7.1(!INT) U$7.19(P16) VOL1.D VOL1.E VOL2.D VOL2.E

## Buses
D[0..6]
ROW_K_#1_[0..15]
COM_1_[0..7]
KS_1_[0..2]

## Notes on the sheet
- Issues Identified after Manufacture
  -------------------------------------------
  1)  NodeLua board width is 5.08 mm too much
  2) DONE - LEDs D3 is incorrectly linked to Row 0 instead of 9.
  3) DONE - Chip enable lines need to be inverted.  This should be done by replacing the 74HC238 with a 74HC138.
  4)   PCF8575 is a TSSOP24 package
- Potential Issues
  -------------------------------------------
  1)  DONE - Encoders on RHS too close to displays
  2)  DONE - Mounting holes for the rotary encoders are not big enough
  3)  DONE - Toggle switch mounting position too cramped  
  4)  DONE - Ideally the HT16K33 should be address 0x71
  5)  DONE - GPIO 23 - No hw control of the i2c multiplexer reset line
  6)  DONE - Location of the power socket
  7)  DONE - put in a bridge - In situ adjustment of the buck converter is dangerous.  Needed to be turned all the way down 
  and then wound up with a meter
  8)  DONE - bit the bullet and made the change - I2C Connectors would be better if they had a different pin arrangement
  9)  NOT DONE - the resistors can go on the external boards - I2C Mux should have pull up resistors on each output
  10) DONE - I2C Mux Connectors are not in numeric order on the board.
  11) DONE - Power Jack might be better moved into the board more so the plug does not overhang the board.
  12) DONE - Replaced by ESP32 - ESP8266 has issues exposing the number of GPIO pins needed for the encoders.
  13) DONE _ Encoder pins need 100nF caps going to ground to debounce.
  14) DONE - Gateron LED leads swapped positioned.  Corrected in Lib.
  15)  Started to see I2C bus problems with OLED display in situ - This seems to have been
  solved with lower PSU voltage.
  16)  DONE - Using chip pull-ups instead of discrete resistors on encoders seems fine.
  17)  DONE - ESP32 fixed this - D8 on Vol1 seems problematic replaced by D4
  18) NOT DONE - left the mounting in place - Having the I2C Master connector on the board seems unnecessary.  Probably
   everything should go via the MUX
  19) DONE - Some of the keyswitch LEDs need to be linked to COM3 because they are floating.
  20) DONE - ADF switch squeezed vertically
  21) JST connector for ADF too close to ADF switch
  22) DONE - ESP32 linked - DLG2416's BL line should be on a PWM pin of the MCU via a MOSFET.
- Issues With V2
  -------------------------------------------
  1)  Board has GND problems.  pin header pin 2 is not linkted to GND.
  Similarly net N$1 should be GND
  2)  The positioning of the 7 Nav keyswitches is about .5mm
  too close together because there is a lip on the keyswitch
- Keyboard and LED control is address 0x71
  I2C Multiplexer is on 0x70
  I2C 16 Bit Expander is on 0x20
  OLED display 0x3C
- Neil Larmour
- V02

## Library data of the parts
74HC138 = Hornet UFC 020a:CD74HC138M: High-Speed CMOS Logic 3- to 8-Line Decoder/Demultiplexer Inverting; MPN: CD74HC138M; OC_FARNELL: 3119872; PACKAGE: SOIC-16; SUPPLIER: Texas Instruments
#0 #1-#9 A/P BCN CLR D/L EMCON ENT I/P IFF ILS ODU1-ODU5 ON/OFF TCN = Hornet UFC 020a:GATERON-LED: Gateron keyswitch with LED
ADF = 000_nl2:JST-PH-B2B-SM3: JST PH Connector 2mm Pitch (3 Pin)
BLANK = microbuilder:SOLDERJUMPER: SMD Solder JUMPER
BRT U$5 U$21 VOL1 VOL2 = Hornet UFC 020a:ALPS_ENCODER+PUSHSWITCH
C2-C13 = rcl:C-EU: CAPACITOR, European symbol
CHANNEL1 = Hornet UFC 020a:16-SEG_: 16 SEGMENT SINGLE DIGIT ALPHANUMERIC NUMERIC DISPLAY
CHANNEL2 = 000_nl2:16-SEG_: 16 SEGMENT SINGLE DIGIT ALPHANUMERIC NUMERIC DISPLAY
CN2 ENC_1 = 000_nl2:JST-PH-B4B-PH-SM4: JST PH 4 Pin (2.00")
D1 D2 = Hornet UFC 020a:BAT54CDW-7-F
D3 D5 D7 D9 D11 = 000_nl2:LED: LED
DIS1-DIS3 ODU_DSP_1-ODU_DSP_3 ODU_DSP_5 = Hornet UFC 020a:HDLX2416: LED DISPLAY 4-character dot matrix
ODU_DSP_4 = 000_nl2:HDLX2416: LED DISPLAY 4-character dot matrix
R1 R2 R5 R7 R9-R12 R14 R49-R60 = rcl:R-EU_: RESISTOR, European symbol; SPICEPREFIX: R
SV2 = 000_nl2:MA20-2: PIN HEADER; OC_FARNELL: unknown; OC_NEWARK: unknown
SW1 = 000_nl2:MICRO_TOGGLE_SPDT
TP1-TP4 = testpad:PTR1: TEST PIN
U$4 U$11 = Hornet UFC 020a:ENCODER_RGB_SWITCH: RGB Switched Rotary Encoder With Switch EC12PRGBSDVBF-D-25K-24-24C-6108-6H Common Anode
U$7 = Hornet UFC 020a:PCF8575: PCF8575 Remote16-BIT I2C AND SMBus I/O Expander with Interrupt Output
U$31 = Hornet UFC 020a:HOLTEK_HT16K33: Holtek HT16K33 RAM Mapping 16*8 LED Controller Driver with keyscan Origianlly tested with the AdaFruit breakout board, the chip is described here <http://www.adafruit.com/datasheets/ht16K33v110.pdf>.
U$37 = Hornet UFC 020a:OLED_128X32_I2C_DISPLAY

## Net classes
1 power: width 0.2 mm